# EAGLE schematic Mood badge (EAGLE 9.5.2)
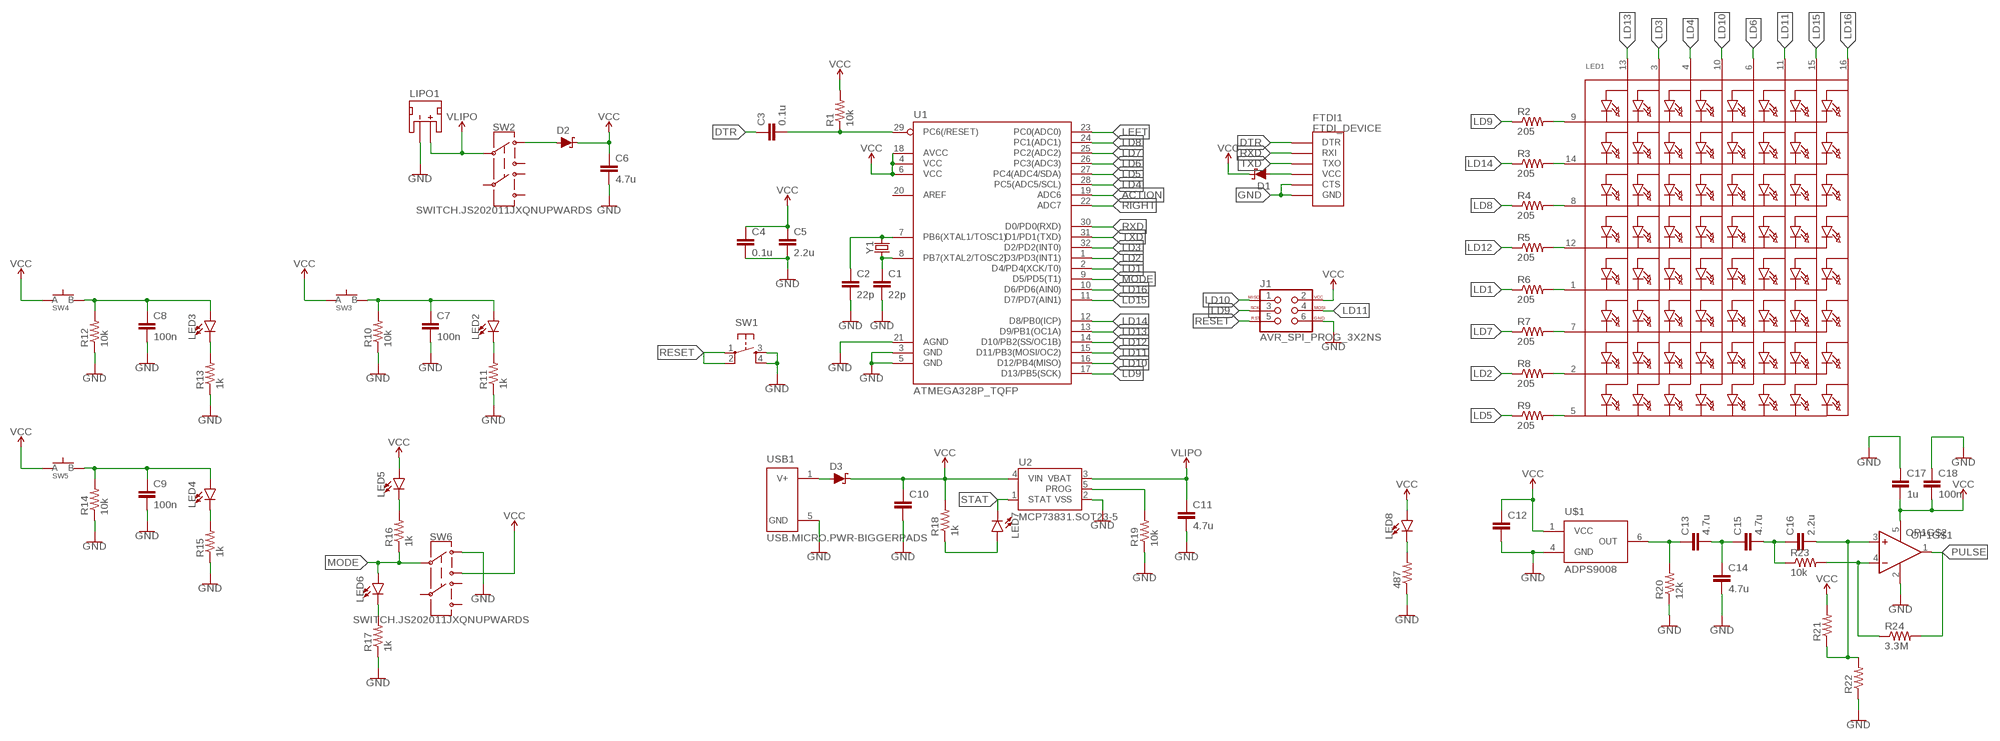
[diagram p0: schematic, sheet 1]

## Parts
487  RESISTOR0603  [R0603]
C1  22p  CAPACITOR0603  [C0603]
C2  22p  CAPACITOR0603  [C0603]
C3  0.1u  CAPACITOR0603  [C0603]
C4  0.1u  CAPACITOR0603  [C0603]
C5  2.2u  CAPACITOR0603  [C0603]
C6  4.7u  CAPACITOR0603  [C0603]
C7  100n  CAPACITOR0603  [C0603]
C8  100n  CAPACITOR0603  [C0603]
C9  100n  CAPACITOR0603  [C0603]
C10  CAPACITOR0603  [C0603]
C11  4.7u  CAPACITOR0603  [C0603]
C12  CAPACITOR0603  [C0603]
C13  4.7u  CAPACITOR0603  [C0603]
C14  4.7u  CAPACITOR0603  [C0603]
C15  4.7u  CAPACITOR0603  [C0603]
C16  2.2u  CAPACITOR0603  [C0603]
C17  1u  CAPACITOR0603  [C0603]
C18  100n  CAPACITOR0603  [C0603]
D1  SCHOTTKY-USC  [USC]
D2  SCHOTTKY-USC  [USC]
D3  SCHOTTKY-USC  [USC]
FTDI1  FTDI_DEVICE  [FTDI_DEVICE]
J1  AVR_SPI_PROG_3X2NS  [2X3-NS]
LED1  SEGMENT_8X8_ROWCATHODEM12A881UR  [SEGMENT_BL-M12A881UR]
LED2  LED0603  [LED-0603]
LED3  LED0603  [LED-0603]
LED4  LED0603  [LED-0603]
LED5  LED0603  [LED-0603]
LED6  LED0603  [LED-0603]
LED7  LED0603  [LED-0603]
LED8  LED0603  [LED-0603]
LIPO1  JST_2MM_MALE  [JST-2-SMD]
OP1  OP-SINGLEOT  [SOT23-5]
R1  10k  RESISTOR0603  [R0603]
R2  205  RESISTOR0603  [R0603]
R3  205  RESISTOR0603  [R0603]
R4  205  RESISTOR0603  [R0603]
R5  205  RESISTOR0603  [R0603]
R6  205  RESISTOR0603  [R0603]
R7  205  RESISTOR0603  [R0603]
R8  205  RESISTOR0603  [R0603]
R9  205  RESISTOR0603  [R0603]
R10  10k  RESISTOR0603  [R0603]
R11  1k  RESISTOR0603  [R0603]
R12  10k  RESISTOR0603  [R0603]
R13  1k  RESISTOR0603  [R0603]
R14  10k  RESISTOR0603  [R0603]
R15  1k  RESISTOR0603  [R0603]
R16  1k  RESISTOR0603  [R0603]
R17  1k  RESISTOR0603  [R0603]
R18  1k  RESISTOR0603  [R0603]
R19  10k  RESISTOR0603  [R0603]
R20  12k  RESISTOR0603  [R0603]
R21  RESISTOR0603  [R0603]
R22  RESISTOR0603  [R0603]
R23  10k  RESISTOR0603  [R0603]
R24  3.3M  RESISTOR0603  [R0603]
SW1  SPST-PTS830GG140  [BUTTON-GULLWING]
SW2  SWITCH.JS202011JXQNUPWARDS  [SWITCH.00]
SW3  SPST.KT11P4SM34LFS  [SPST.KT11P4SM34LFS]
SW4  SPST.KT11P4SM34LFS  [SPST.KT11P4SM34LFS]
SW5  SPST.KT11P4SM34LFS  [SPST.KT11P4SM34LFS]
SW6  SWITCH.JS202011JXQNUPWARDS  [SWITCH.00]
U1  ATMEGA328P_TQFP  [TQFP32-08]
U2  MCP73831.SOT23-5  [SOT23-5]
U$1  ADPS9008  [6-PIN.CHIPLED]
USB1  USB.MICRO.PWR-BIGGERPADS  [USB-MICRO-01.BIGGERPADS.PWR]
Y1  CRYSTAL-CA-310  [CA-301]

## Nets
ACTION: U1.19(ADC6)
DTR: C3.1 FTDI1.DTR
GND: 487.1 C1.2 C2.2 C4.2 C5.2 C6.2 C7.2 C8.2 C9.2 C10.2 C11.2 C12.2 C14.2 C17.1 C18.1 FTDI1.CTS FTDI1.GND J1.6 LIPO1.1(-) OP1.2(V-) R11.1 R13.1 R15.1 R17.1 R19.1 R20.1 R22.1 SW1.3 SW1.4 SW6.1 U1.3(GND) U1.5(GND) U1.21(AGND) U2.2(VSS) U$1.4(GND) USB1.5(GND)
LD1: R6.1 U1.2(D4/PD4(XCK/T0))
LD2: R8.1 U1.1(D3/PD3(INT1))
LD3: LED1.3(A2) U1.32(D2/PD2(INT0))
LD4: LED1.4(A3) U1.28(PC5(ADC5/SCL))
LD5: R9.1 U1.27(PC4(ADC4/SDA))
LD6: LED1.6(A5) U1.26(PC3(ADC3))
LD7: R7.1 U1.25(PC2(ADC2))
LD8: R4.1 U1.24(PC1(ADC1))
LD9: J1.3 R2.1 U1.17(D13/PB5(SCK))
LD10: J1.1 LED1.10(A4) U1.16(D12/PB4(MISO))
LD11: J1.4 LED1.11(A6) U1.15(D11/PB3(MOSI/OC2))
LD12: R5.1 U1.14(D10/PB2(SS/OC1B))
LD13: LED1.13(A1) U1.13(D9/PB1(OC1A))
LD14: R3.1 U1.12(D8/PB0(ICP))
LD15: LED1.15(A7) U1.11(D7/PD7(AIN1))
LD16: LED1.16(A8) U1.10(D6/PD6(AIN0))
LEFT: U1.23(PC0(ADC0))
MODE: LED6.A R16.1 SW6.2 U1.9(D5/PD5(T1))
N$1: C1.1 U1.8(PB7(XTAL2/TOSC2)) Y1.1
N$2: C2.1 U1.7(PB6(XTAL1/TOSC1)) Y1.2
N$3: C3.2 R1.1 U1.29(PC6(/RESET))
N$4: LED1.9(K1) R2.2
N$5: LED1.14(K2) R3.2
N$6: LED1.8(K3) R4.2
N$7: LED1.12(K4) R5.2
N$8: LED1.1(K5) R6.2
N$9: D1.+(A) FTDI1.VCC
N$10: LED1.7(K6) R7.2
N$11: LED1.2(K7) R8.2
N$12: LED1.5(K8) R9.2
N$13: D2.+(A) SW2.1
N$14: LIPO1.2(+) SW2.2 ; supply symbol labelled VLIPO
N$15: C8.1 LED3.A R12.2 SW4.3(B) SW4.4(B)
N$16: C7.1 LED2.A R10.2 SW3.3(B) SW3.4(B)
N$17: R10.1 R12.1 R14.1 ; supply symbol labelled GND
N$18: LED3.C R13.2
N$19: LED2.C R11.2
N$20: C9.1 LED4.A R14.2 SW5.3(B) SW5.4(B)
N$21: LED4.C R15.2
N$22: LED6.C R17.2
N$23: LED5.C R16.2
N$24: D3.+(A) USB1.1(V+)
N$25: 487.2 LED8.C
N$26: LED7.A R18.1
N$27: R19.2 U2.5(PROG)
N$28: C15.2 C16.1 R23.1
N$29: C16.2 OP1.3(+IN) R21.1 R22.2
N$30: C13.1 R20.2 U$1.6(OUT)
N$31: C13.2 C14.1 C15.1
N$33: OP1.4(-IN) R23.2 R24.1
PULSE: OP1.1(OUT) R24.2
RESET: J1.5 SW1.1 SW1.2
RIGHT: U1.22(ADC7)
RXD: FTDI1.TXO(RXI) U1.30(D0/PD0(RXD))
STAT: LED7.C U2.1(STAT)
TXD: FTDI1.RXI(TXO) U1.31(D1/PD1(TXD))
VCC: C4.1 C5.1 C6.1 C10.1 C12.1 C17.2 C18.2 D1.-(C) D2.-(C) D3.-(C) J1.2 LED5.A LED8.A OP1.5(V+) R1.2 R18.2 R21.2 SW3.1(A) SW3.2(A) SW4.1(A) SW4.2(A) SW5.1(A) SW5.2(A) SW6.3 U1.4(VCC) U1.6(VCC) U1.18(AVCC) U2.4(VIN) U$1.1(VCC)
VLIPO: C11.1 U2.3(VBAT)
Unconnected: LIPO1.NC1(PAD1) LIPO1.NC2(PAD2) SW2.3 SW2.5 SW2.6 SW2.7 SW6.5 SW6.6 SW6.7 U1.20(AREF)

## Library data of the parts
487 R1-R24 = LinnesLab-Passives:RESISTOR
C1-C18 = LinnesLab-Passives:CAPACITOR
D1-D3 = LinnesLab-DiscreteSemi:SCHOTTKY: Schottky diode A Schottky diode is a semiconductor diode which has a low forward voltage drop and a very fast switching action. Example: Digi-Key Part Number: RB161MM-20CT-ND
FTDI1 = LinnesLab-Connectors:FTDI_DEVICE
J1 = LinnesLab-Connectors:AVR_SPI_PROG_3X2: AVR ISP 6 Pin This is the reduced ISP connector for AVR programming. Common on Arduino. This footprint will take up less PCB space and can be used with a 10-pin to 6-pin adapter such as SKU: BOB-08508 **Special note about "TEST_POINT" package. The stop mask is on the top side, so if you want your programming test points to be on the bottom of your board, make sure to place this package on the bottom side of the board. This also ensure that the orientation to program from the bottom side will be correct. SparkFun Products: SparkFun ISP Pogo Adapter <https://www.sparkfun.com/products/11591> - NS Tiny AVR Programmer <https://www.sparkfun.com/products/11801> -PTH
LED1 = adafruit:SEGMENT_8X8_ROWCATHODE: 8x8 LED Segment Displays: Row = Cathode 0.7" Red 8X8 Matrix, 1.9mm Round LEDs - BL-M07C881UR 1.2" Red 8x8 Matrix, 3.0mm Round LEDs - BL-M12A881UR 1.2" Red 8x8 Matrix, 3.0mm Square LEDs - BL-M12A883
LED2-LED8 = LinnesLab-LED:LED: LED (Generic) Standard schematic elements and footprints for 5mm, 3mm, 1206, and 0603 sized LEDs. Generic LEDs with no color specified. LTST-C190KGKT: arrow indicates cathode
LIPO1 = LinnesLab-Connectors:JST_2MM_MALE: JST 2MM MALE RA CONNECTOR Two pin, compact surface mount connector. Commonly used as a battery input connection point. We really like the solid locking feeling and high current rating on these small connectors. We use these all the time as battery connectors. Mates to single-cell LiPo batteries. Here is the connector we sell at SparkFun: JST Right Angle Connector - White <https://www.sparkfun.com/products/8612> (PRT-08612) Datasheet <http://www.sparkfun.com/datasheets/Prototyping/Connectors/JST-Horizontal.pdf> It was used on these SparkFun products: SparkFun MOSFET Power Controller <https://www.sparkfun.com/products/11214> (PRT-11214) SparkFun Battery Babysitter - LiPo Battery Manager <https://www.sparkfun.com/products/13777> (PRT-13777) And many, many others that required a lipo battery connection.; PROD_ID: CONN-11443; SF_ID: PRT-08612
OP1 = LinnesLab-AnalogIC:OP-SINGLE: Single Op Amp 2.7V to 6.0V Single Supply CMOS Source: http://ww1.microchip.com/downloads/en/DeviceDoc/21314g.pdf
SW1 = LinnesLab-Switches:SPST-PTS830GG140
SW2 SW6 = LinnesLab-Switches:SWITCH.JS202011JXQN: Manufacturer's Part Numer: JS202011JAQN for right angle throw JS202011JCQN for top side throw
SW3-SW5 = LinnesLab-Switches:SPST.KT11P4SM34LFS: https://www.ckswitches.com/media/1468/kt.pdf
U1 = LinnesLab-Microcontrollers:ATMEGA328P_TQFP: Popular 328P in QFP Storefront component: ATmega328 - TQFP <https://www.sparkfun.com/products/13448> (COM-13448) Datasheet <http://www.sparkfun.com/datasheets/Components/SMD/ATMega328.pdf> SparkFun Products SparkFun RedBoard - Programmed with Arduino <https://www.sparkfun.com/products/12757> (DEV-12757) Arduino Pro Mini 328 - 5V/16MHz <https://www.sparkfun.com/products/11113> (DEV-11113) Arduino Pro Mini 328 - 3.3V/8MHz <https://www.sparkfun.com/products/11114> (DEV-11114) SparkFun OpenLog <https://www.sparkfun.com/products/13712> (DEV-13712) SparkFun MicroView - OLED Arduino Module <https://www.sparkfun.com/products/12923> (DEV-12923) SparkFun Digital Sandbox <https://www.sparkfun.com/products/12651> (DEV-12651) SparkFun PicoBoard <https://www.sparkfun.com/products/11888> (WIG-11888) Arduino Fio <https://www.sparkfun.com/products/10116> (DEV-10116) LilyPad Arduino 328 Main Board <https://www.sparkfun.com/products/13342> (DEV-13342) SparkFun RedStick <https://www.sparkfun.com/products/13741> (DEV-13741) LilyPad MP3 <https://www.sparkfun.com/products/11013> (DEV-11013) LilyPad Arduino SimpleSnap <https://www.sparkfun.com/products/10941> (DEV-10941) SparkFun Stepoko <https://www.sparkfun.com/products/13899> (ROB-13899) SparkFun Geiger Counter <https://www.sparkfun.com/products/11345> (SEN-11345) SparkFun EL Sequencer <https://www.sparkfun.com/products/12781> (COM-12781) Arduino Pro 328 - 5V/16MHz <https://www.sparkfun.com/products/10915> (DEV-10915) CryptoCape <https://www.sparkfun.com/products/12773> (DEV-12773) SparkFun IR Thermometer Evaluation Board - MLX90614 <https://www.sparkfun.com/products/10740> (SEN-10740) SparkFun RedBot Mainboard <https://www.sparkfun.com/products/12097> (ROB-12097) Arduino Pro 328 - 3.3V/8MHz <https://www.sparkfun.com/products/10914> (DEV-10914) SparkFun Block for Intel® Edison - Arduino <https://www.sparkfun.com/products/13036> (DEV-13036) SparkFun Simon Says - Surface Mount Soldering Kit <https://www.sparkfun.com/products/10935> (KIT-10935) SparkFun 7-Segment Serial Display - Red <https://www.sparkfun.com/products/11441> (COM-11441) SparkFun 7-Segment Serial Display - White <https://www.sparkfun.com/products/11629> (COM-11629) SparkFun 7-Segment Serial Display - Yellow <https://www.sparkfun.com/products/11443> (COM-11443) SparkFun 7-Segment Serial Display - Kelly Green <https://www.sparkfun.com/products/11440> (COM-11440) SparkFun 7-Segment Serial Display - Blue <https://www.sparkfun.com/products/11442> (COM-11442) SparkFun OpenSegment Serial Display - 20mm (Blue) <https://www.sparkfun.com/products/11647> (COM-11647) SparkFun OpenSegment Serial Display - 20mm (Green) <https://www.sparkfun.com/products/11646> (COM-11646) SparkFun OpenSegment Serial Display - 20mm (White) <https://www.sparkfun.com/products/11648> (COM-11648) SparkFun OpenSegment Serial Display - 20mm (Red) <https://www.sparkfun.com/products/11644> (COM-11644) SparkFun OpenSegment Serial Display - 20mm (Yellow) <https://www.sparkfun.com/products/11645> (COM-11645) SparkFun OpenSegment Shield <https://www.sparkfun.com/products/13190> (DEV-13190); PROD_ID: IC-09069
U2 = LinnesLab-Power:MCP73831
U$1 = LinnesLab-Sensors:ADPS9008
USB1 = LinnesLab-Connectors:USB.MICRO.PWR
Y1 = LinnesLab-Clocks:CRYSTAL-CA-310